# Altium project Placa.PrjPcb
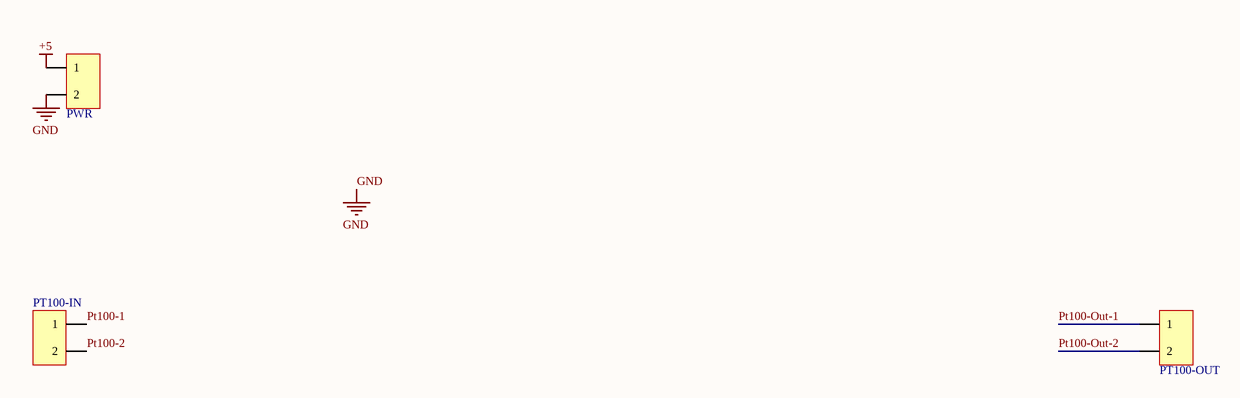
[diagram p0: IO.SchDoc]
2 sheets, 16 parts. Net scope: global (net labels, ports and power ports of the same name join across sheets).
Board file: PCB1.PcbDoc
Sheets:
  IO.SchDoc
  Condicionamento - Temperatura.SchDoc

## Sheet IO.SchDoc
size A

### Parts
PT100-IN  691253510002  [691253510002]  (value not drawn)
PT100-OUT  691253510002  [691253510002]  (value not drawn)
PWR  691253510002  [691253510002]  (value not drawn)

### Nets
+5: PWR.1
GND: PT100-IN.2 PT100-OUT.2 PWR.2  [also labelled Pt100-2, Pt100-Out-2]
Pt100-1: PT100-IN.1
Pt100-Out-1: PT100-OUT.1

### Library data of the parts
PT100-IN PT100-OUT PWR = 691253510002: Horizontal Cable Entry with Rising Cage Clamp, Serie 2535 - 5.08mm; Manufacturer: Wurth Elektronik; ComponentLink1 Description: Manufacturer; ComponentLink2 Description: Datasheet; NoPins: 2; ComponentLink1 URL: http://www.we-online.com; ComponentLink2 URL: http://katalog.we-online.de/em/datasheet/6912535100xx.pdf; Created By: Baojun Chen; Created Date: 27.Aug.2015; PartNo: 691253510002

## Sheet Condicionamento - Temperatura.SchDoc
size A
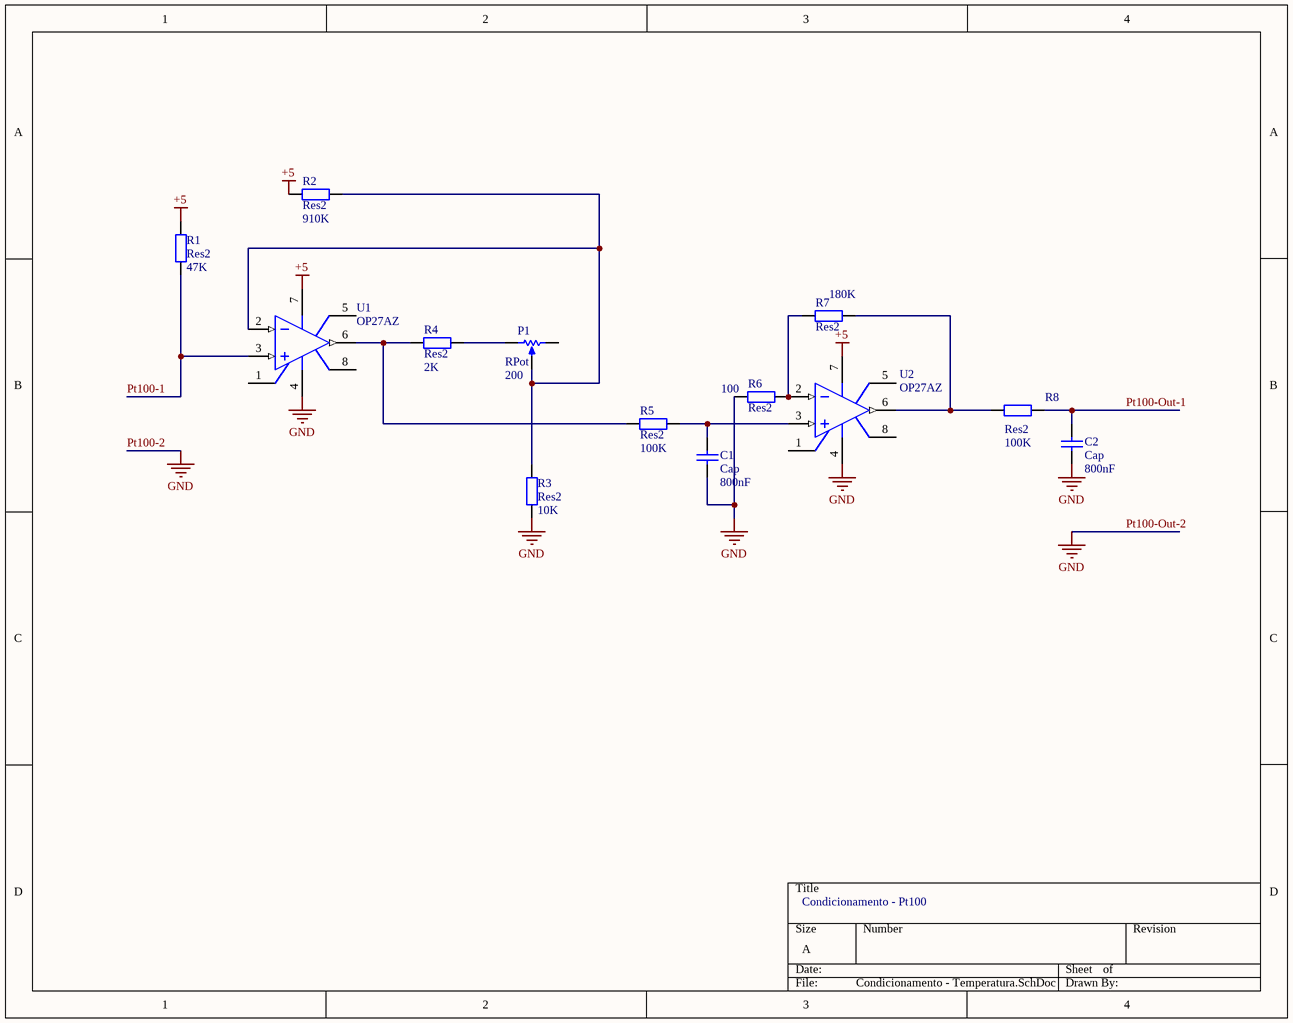
[diagram p1: Condicionamento - Temperatura.SchDoc]

### Parts
C1  Cap  value 800nF  [RAD-0.3]
C2  Cap  value 800nF  [RAD-0.3]
P1  RPot  value 200  [VR5]
R1  Res2  value 47K  [AXIAL-0.4]
R2  Res2  value 910K  [AXIAL-0.4]
R3  Res2  value 10K  [AXIAL-0.4]
R4  Res2  value 2K  [AXIAL-0.4]
R5  Res2  value 100K  [AXIAL-0.4]
R6  Res2  value 100  [AXIAL-0.4]
R7  Res2  value 180K  [AXIAL-0.4]
R8  Res2  value 100K  [AXIAL-0.4]
U1  OP27AZ  [Q-8]
U2  OP27AZ  [Q-8]

### Nets
+5: R1.2 R2.1 U1.7(V+) U2.7(V+)
GND: C1.1 C2.1 R3.1 R6.1 U1.4(V-) U2.4(V-)  [also labelled Pt100-2, Pt100-Out-2]
Pt100-1: R1.1 U1.3(IN+)
Pt100-Out-1: C2.2 R8.2
NetC1_2: C1.2 R5.2 U2.3(IN+)
NetP1_1: P1.1(TOP) R4.2
NetP1_3: P1.3(TAP) R2.2 R3.2 U1.2(IN-)
NetR4_1: R4.1 R5.1 U1.6(OUT)
NetR6_2: R6.2 R7.1 U2.2(IN-)
NetR7_2: R7.2 R8.1 U2.6(OUT)

Not connected (* = marked no-connect by the designer): P1 2(BOT); U1 1(CMPEN) 5(NC) 8(CMPEN); U2 1(CMPEN) 5(NC) 8(CMPEN)

### Notes on the sheet
- Condicionamento - Pt100

### Library data of the parts
C1 C2 = Cap: Capacitor; Published: 8-Jun-2000; LatestRevisionDate: 17-Jul-2002; LatestRevisionNote: Re-released for DXP Platform.; PackageReference: RAD-0.3; Publisher: Altium Limited; PackageDescription: Radial Cap, Thru-Hole; 2 Leads; 0.3 in Pin Spacing
P1 = RPot: Potentiometer; Sim Note: Enter the Resistance value and the set point into parameter fields.; Set Position: 0.5; Published: 8-Jun-2000; LatestRevisionDate: 17-Jul-2002; LatestRevisionNote: Re-released for DXP Platform.; PackageReference: VR5; Publisher: Altium Limited; PackageDescription: Variable Resistor, Thru-Hole; 3 Leads
R1-R8 = Res2: Resistor; Published: 8-Jun-2000; LatestRevisionDate: 17-Jul-2002; LatestRevisionNote: Re-released for DXP Platform.; PackageReference: AXIAL-0.4; Publisher: Altium Limited; PackageDescription: Axial Device, Thru-Hole; 2 Leads; 0.4 in Pin Spacing
U1 U2 = OP27AZ: Low-Noise, Precision Operational Amplifier; Note: Pin 5 is not connected.; Published: 8-Jun-2000; LatestRevisionDate: 04-Mar-2005; LatestRevisionNote: Stylized 3D Model Added.; DatasheetVersion: 1992; PackageVersion: 1998; PackageReference: Q-8; Publisher: Altium Limited; PackageDescription: DIP; 8 Leads; Row Spacing 7.62 mm; Pitch 2.54 mm; ComponentLink1Description: Manufacturer Link; ComponentLink1URL: http://www.analog.com/en/prod/0,,759_786_OP27%2C00.html; ComponentLink2Description: Datasheet; ComponentLink2URL: http://www.analog.com/UploadedFiles/Data_Sheets/314538596OP27_c.pdf

## Nets that join several sheets
+5: IO (PWR.1), Condicionamento - Temperatura (R1.2 R2.1 U1.7 U2.7)
GND: IO (PT100-IN.2 PT100-OUT.2 PWR.2), Condicionamento - Temperatura (6 pins)
Pt100-1: IO (PT100-IN.1), Condicionamento - Temperatura (R1.1 U1.3)
Pt100-Out-1: IO (PT100-OUT.1), Condicionamento - Temperatura (C2.2 R8.2)